# EAGLE design sch_sondax3 (EAGLE 9.6.2)
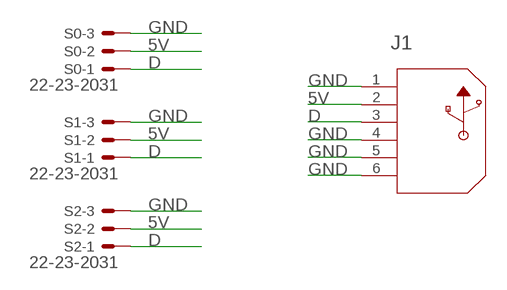
[diagram p0: schematic, sheet 1]

## Parts
J1  292303-3  [CONN4_292303_TEC]
S0  22-23-2031  [22-23-2031]
S1  22-23-2031  [22-23-2031]
S2  22-23-2031  [22-23-2031]

## Nets
5V: J1.2 S0.2 S1.2 S2.2
D: J1.3 S0.1 S1.1 S2.1
GND: J1.1 J1.4 J1.5 J1.6 S0.3 S1.3 S2.3

## Library data of the parts
J1 = USB_A_TH:292303-3; BUILT_BY: EMA_UL_Team; COPYRIGHT: Copyright (C) 2016 Accelerated Designs. All rights reserved; DESCRIPTION: USB A R/A RCPT ASSY THRU HOLE, LEAD FREE; MANUFACTURER_PART_NUMBER: 292303-3; PITCH_MM_: 2.5; POSITIONS: 4; PRODUCT: Connector; ROWS-CONFIG: 1; SOURCELIBRARY: TE_Connectivity-2018-03-16; TE_PART_NUMBER: 292303-3; TYPE: USB 2.0; VENDOR: TE Connectivity
S0 S1 S2 = con-molex:22-23-2031: .100" (2.54mm) Center Header - 3 Pin; MF: MOLEX; MPN: 22-23-2031; OC_FARNELL: 1462950; OC_NEWARK: 30C0862

## Board
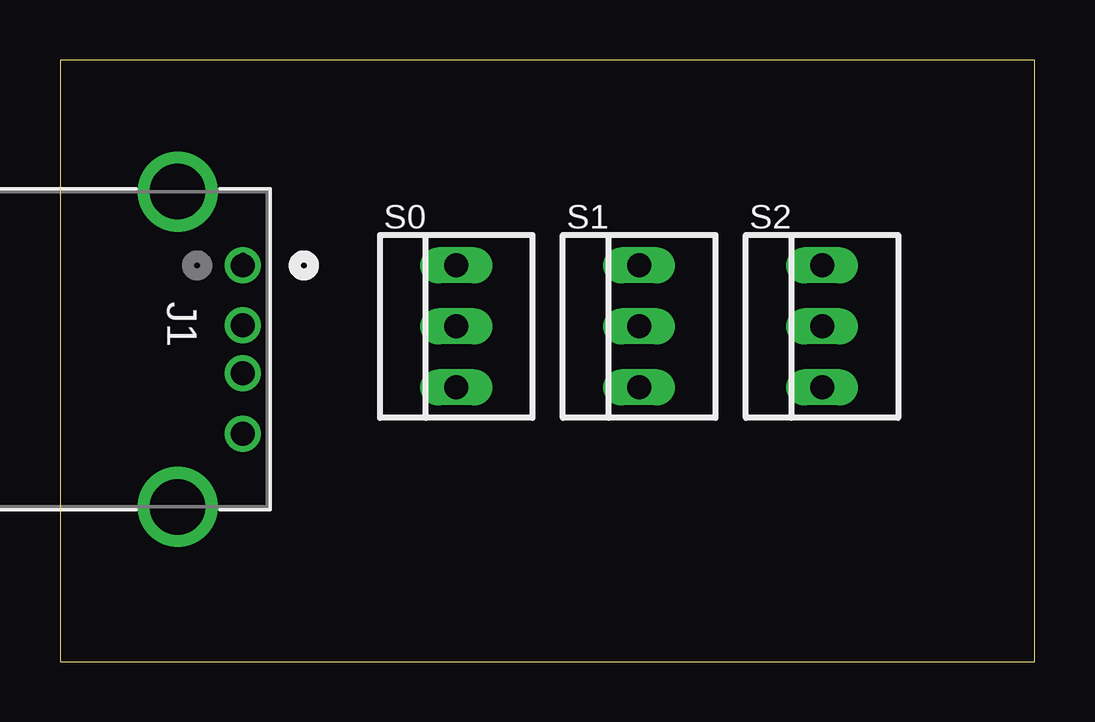
[diagram p1: board, top side]
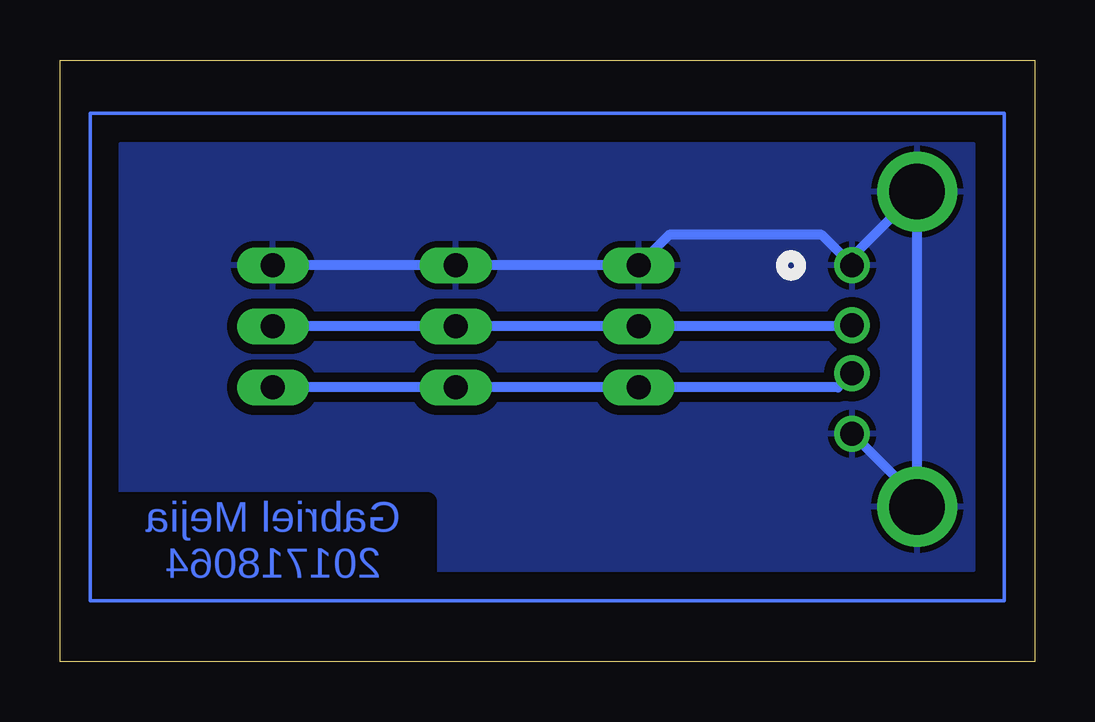
[diagram p2: board, bottom side, seen from below]

Size 40.62 x 25.07 mm. Coordinates in mm from the lower left corner, seen from the top.
Outline: 0,25.07 0,0 40.62,0 40.62,25.07 0,25.07
Copper layers (1*16): Top 0.035mm / dielectric 1.5mm / Bottom 0.035mm
Design rules "default": minimum track width 6mil, minimum drill 0.35mm, track to track 6mil, track to pad 6mil, pad to pad 6mil, via to via 6mil, smd to smd 6mil, copper to edge 40mil, drill to drill 6mil, minimum pad ring 10mil, minimum via ring 8mil, stop-mask expansion 4mil, vias tented up to drill 0mil, thermal gap 10mil

### Footprints (pad centres in the part's own frame; a part is rotated, then mirrored left to right if it is on the bottom)
CONN4_292303_TEC = drill 0.991 pad 1.499: 1 0,0; 2 2.489,0; 3 4.496,0; 4 7.01,0 | drill 2.311 pad 2.819: 5 -3.073,-2.718; 6 10.058,-2.718
22-23-2031 = drill 1 long: 1 -2.54,0; 2 0,0; 3 2.54,0

### Placement (x,y rotation side)
J1  7.62,16.51 270 top
S0  16.51,13.97 90 top
S1  24.13,13.97 90 top
S2  31.75,13.97 90 top

### Tracks (layer width: path | path; a pad name or v marks a point on that pad's centre or on a via)
5V  (via drill 0.35)
  Top 0.152: J1.2 v7.67,13.97
  Bottom 0.406: v7.67,13.97 S0.2 S1.2 S2.2
D
  Bottom 0.406: S2.1 S1.1 S0.1 8.2,11.43 J1.3
GND  (via drill 0.35)
  Top 0.152: v7.62,16.87 J1.1 | 4.9,6.78 J1.6
  Bottom 0.406: J1.6 J1.5 v7.62,16.87 | S2.3 S1.3 S0.3 15.24,17.78 8.89,17.78 J1.1 | J1.4 4.9,6.78
  pour Bottom (isolate 0.406): 2.54,21.59 38.1,21.59 38.1,3.81 2.54,3.81
N$1
  Bottom 0.152: 1.27,22.86 1.27,2.54 39.37,2.54 39.37,22.86 1.27,22.86

### Text on the board
Bottom: Gabriel Mejia / 201718064